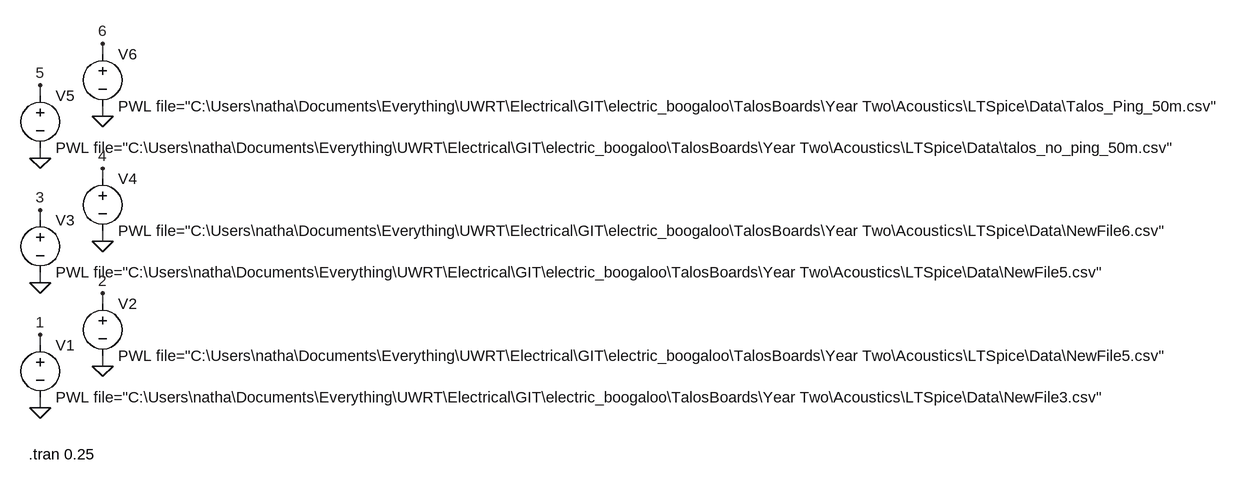
[diagram p0: schematic Recorded Data Comparison.asc]
Recorded Data Comparison.asc, the LTspice schematic file:
Version 4
SHEET 1 2456 680
WIRE 112 -288 112 -304
WIRE 16 -224 16 -240
WIRE 112 -192 112 -208
WIRE 16 -128 16 -144
WIRE 112 -96 112 -112
WIRE 16 -32 16 -48
WIRE 112 0 112 -16
WIRE 16 64 16 48
WIRE 112 96 112 80
WIRE 16 160 16 144
WIRE 112 192 112 176
WIRE 16 256 16 240
FLAG 16 256 0
FLAG 112 192 0
FLAG 16 64 0
FLAG 112 0 0
FLAG 16 -128 0
FLAG 112 -192 0
FLAG 16 144 1
FLAG 112 80 2
FLAG 16 -48 3
FLAG 112 -112 4
FLAG 16 -240 5
FLAG 112 -304 6
SYMBOL voltage 16 144 R0
WINDOW 123 0 0 Left 0
WINDOW 39 0 0 Left 0
SYMATTR InstName V1
SYMATTR Value PWL file="C:\Users\natha\Documents\Everything\UWRT\Electrical\GIT\electric_boogaloo\TalosBoards\Year Two\Acoustics\LTSpice\Data\NewFile3.csv"
SYMBOL voltage 112 80 R0
WINDOW 123 0 0 Left 0
WINDOW 39 0 0 Left 0
SYMATTR InstName V2
SYMATTR Value PWL file="C:\Users\natha\Documents\Everything\UWRT\Electrical\GIT\electric_boogaloo\TalosBoards\Year Two\Acoustics\LTSpice\Data\NewFile5.csv"
SYMBOL voltage 16 -48 R0
WINDOW 123 0 0 Left 0
WINDOW 39 0 0 Left 0
SYMATTR InstName V3
SYMATTR Value PWL file="C:\Users\natha\Documents\Everything\UWRT\Electrical\GIT\electric_boogaloo\TalosBoards\Year Two\Acoustics\LTSpice\Data\NewFile5.csv"
SYMBOL voltage 112 -112 R0
WINDOW 123 0 0 Left 0
WINDOW 39 0 0 Left 0
SYMATTR InstName V4
SYMATTR Value PWL file="C:\Users\natha\Documents\Everything\UWRT\Electrical\GIT\electric_boogaloo\TalosBoards\Year Two\Acoustics\LTSpice\Data\NewFile6.csv"
SYMBOL voltage 16 -240 R0
WINDOW 123 0 0 Left 0
WINDOW 39 0 0 Left 0
SYMATTR InstName V5
SYMATTR Value PWL file="C:\Users\natha\Documents\Everything\UWRT\Electrical\GIT\electric_boogaloo\TalosBoards\Year Two\Acoustics\LTSpice\Data\talos_no_ping_50m.csv"
SYMBOL voltage 112 -304 R0
WINDOW 123 0 0 Left 0
WINDOW 39 0 0 Left 0
SYMATTR InstName V6
SYMATTR Value PWL file="C:\Users\natha\Documents\Everything\UWRT\Electrical\GIT\electric_boogaloo\TalosBoards\Year Two\Acoustics\LTSpice\Data\Talos_Ping_50m.csv"
TEXT -2 328 Left 2 !.tran 0.25

The netlist it stands for:
* Recorded Data Comparison.asc
V1 1 0 PWL file="C:\Users\natha\Documents\Everything\UWRT\Electrical\GIT\electric_boogaloo\TalosBoards\Year Two\Acoustics\LTSpice\Data\NewFile3.csv"
V2 2 0 PWL file="C:\Users\natha\Documents\Everything\UWRT\Electrical\GIT\electric_boogaloo\TalosBoards\Year Two\Acoustics\LTSpice\Data\NewFile5.csv"
V3 3 0 PWL file="C:\Users\natha\Documents\Everything\UWRT\Electrical\GIT\electric_boogaloo\TalosBoards\Year Two\Acoustics\LTSpice\Data\NewFile5.csv"
V4 4 0 PWL file="C:\Users\natha\Documents\Everything\UWRT\Electrical\GIT\electric_boogaloo\TalosBoards\Year Two\Acoustics\LTSpice\Data\NewFile6.csv"
V5 5 0 PWL file="C:\Users\natha\Documents\Everything\UWRT\Electrical\GIT\electric_boogaloo\TalosBoards\Year Two\Acoustics\LTSpice\Data\talos_no_ping_50m.csv"
V6 6 0 PWL file="C:\Users\natha\Documents\Everything\UWRT\Electrical\GIT\electric_boogaloo\TalosBoards\Year Two\Acoustics\LTSpice\Data\Talos_Ping_50m.csv"
.tran 0.25
.backanno
.end